# Altium schematic sheet SIM900A&W5500.SchDoc
size A2
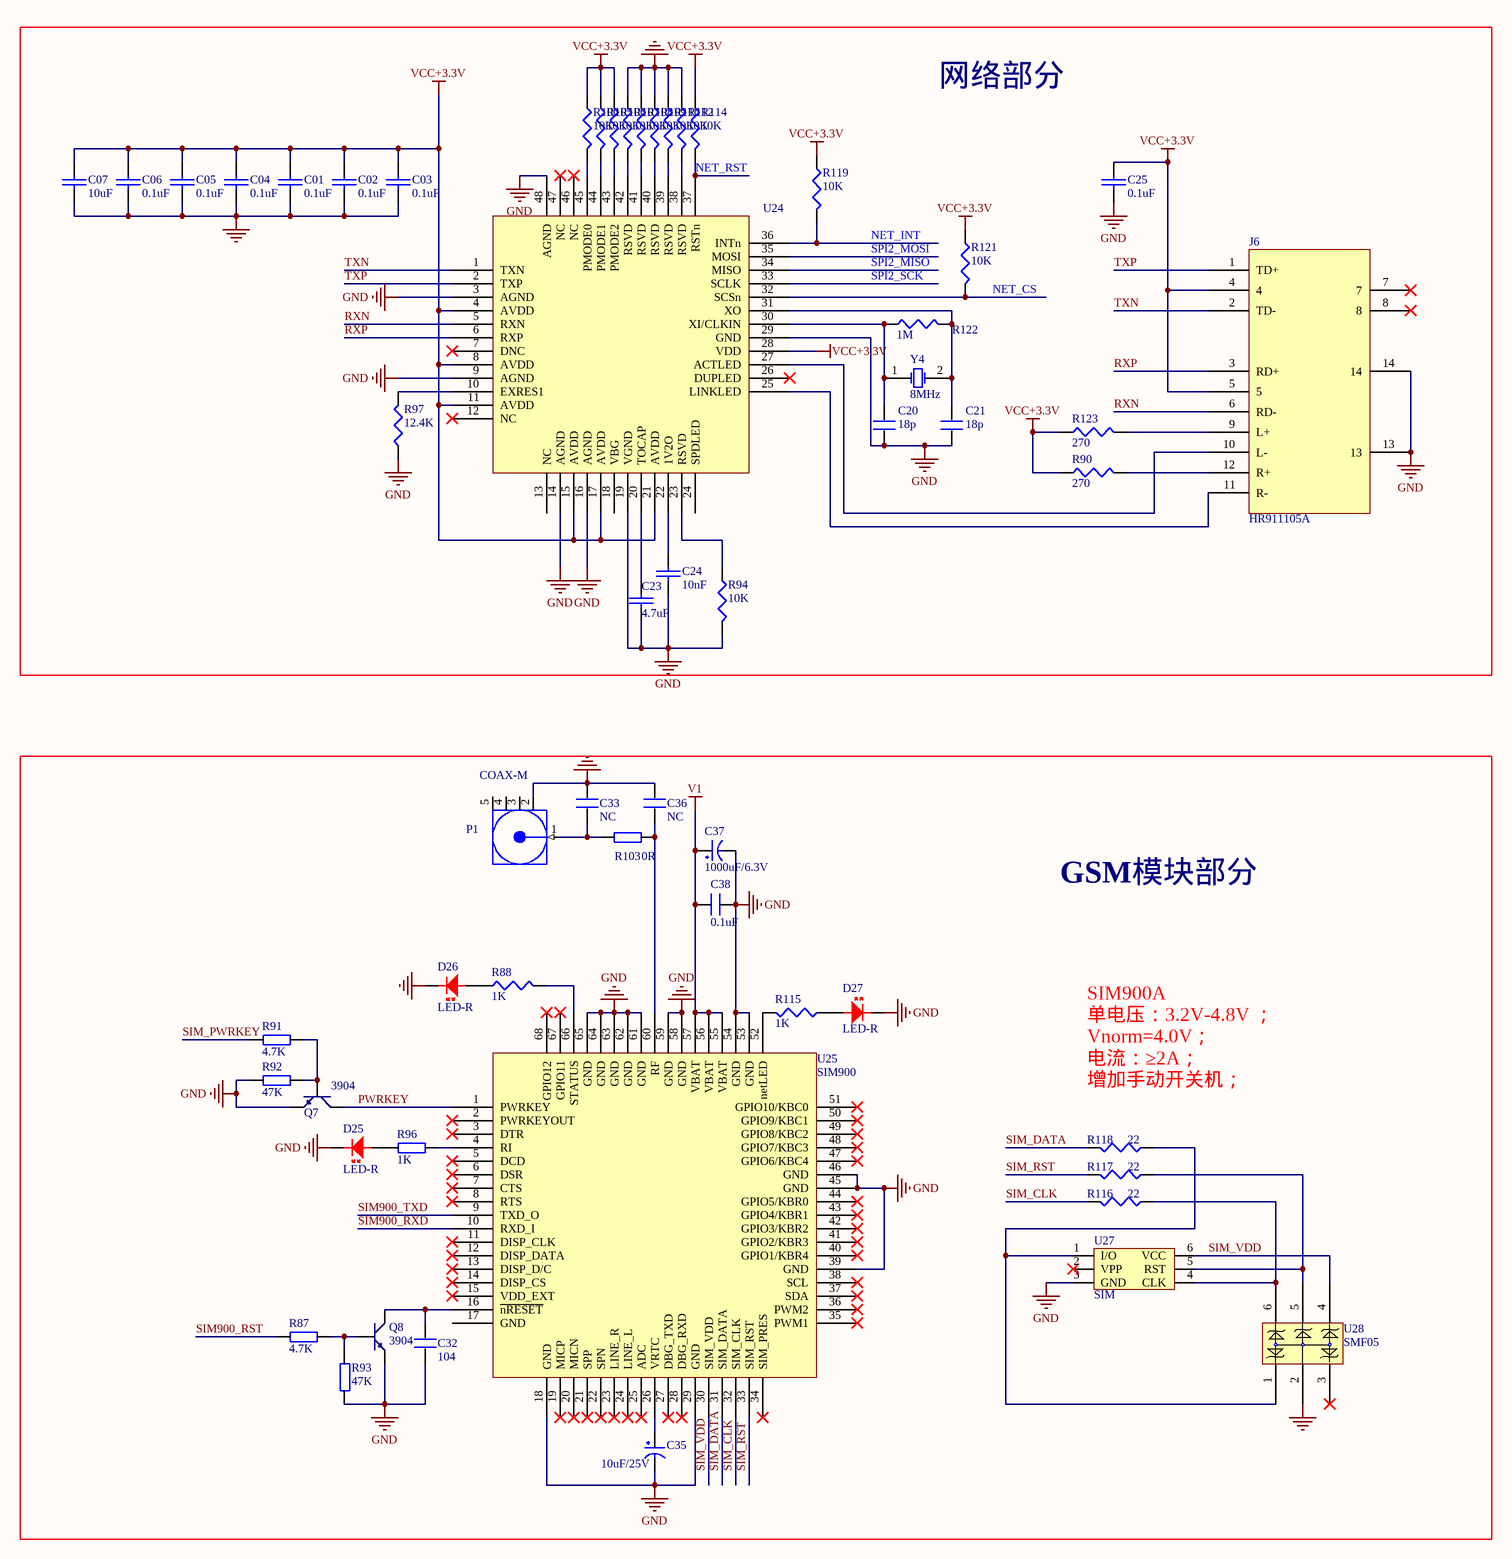
[diagram p0: SIM900A&W5500.SchDoc]

## Parts
C01  0.1uF  [0603]
C02  0.1uF  [0603]
C03  0.1uF  [0603]
C04  0.1uF  [0603]
C05  0.1uF  [0603]
C06  0.1uF  [0603]
C07  10uF  [0805]
C20  18p  [0603]
C21  18p  [0603]
C23  4.7uF  [0603]
C24  10nF  [0603]
C25  0.1uF  [0603]
C32  104  [0805]
C33  NC  [0805]
C35  10uF/25V  [1206]
C36  NC  [0805]
C37  1000uF/6.3V  [7343]
C38  0.1uF  [0805]
D25  LED-R  [LED-DIP]
D26  LED-R  [LED-DIP]
D27  LED-R  [LED-DIP]
J6  HR911105A  [HR911105A]
P1  COAX-M  [ST-TH1]
Q7  3904  [SOT-23R]
Q8  3904  [SOT-23R]
R87  4.7K  [0805]
R88  1K  [0805]
R90  270  [0603]
R91  4.7K  [0805]
R92  47K  [0805]
R93  47K  [0805]
R94  10K  [0603]
R96  1K  [0805]
R97  12.4K  [0603]
R100  10K  [0603]
R103  0R  [0603]
R105  10K  [0603]
R106  10K  [0603]
R107  10K  [0603]
R108  10K  [0603]
R109  10K  [0603]
R110  10K  [0603]
R112  10K  [0603]
R114  10K  [0603]
R115  1K  [0805]
R116  22  [0805]
R117  22  [0805]
R118  22  [0805]
R119  10K  [0603]
R121  10K  [0603]
R122  1M  [0603]
R123  270  [0603]
U24  W5500  [LQFP48_N]  (value not drawn)
U25  SIM900  [SIM-900]
U27  SIM  [sim-6p]
U28  SMF05  [SC70-6L]
Y4  8MHz  [XTAL_US]

## Blocks framed on the sheet
网络部分: C01 C02 C03 C04 C05 C06 C07 C20 C21 C23-C25 J6 R90 R94 R97 R100 R105-R110 R112 R114 R119 R121-R123 U24 Y4
GSM模块部分: C32 C33 C35-C38 D25-D27 P1 Q7 Q8 R87 R88 R91-R93 R96 R103 R115-R118 U25 U27 U28

## Nets
GND: C01.2 C02.2 C03.2 C04.2 C05.2 C06.2 C07.1 C20.1 C21.1 C23.1 C24.2 C25.2 C32.1 C33.2 C35.2(GND) C36.2 C37.2(GND) C38.2 D25.2 D26.2 D27.2 J6.13 J6.14 P1.2(GND) Q7.1(E) Q8.1(E) R92.1 R93.1 R94.2 R97.1 R107.1 R108.1 R109.1 R110.1 R112.1 U24.3(AGND) U24.9(AGND) U24.14(AGND) U24.16(AGND) U24.19(VGND) U24.29(GND) U24.48(AGND) U25.18(GND) U25.29(GND) U25.39(GND) U25.45(GND) U25.46(GND) U25.53(GND) U25.54(GND) U25.58(GND) U25.59(GND) U25.61(GND) U25.62(GND) U25.63(GND) U25.64(GND) U25.65(GND) U27.3(GND) U28.2
V1: C37.1(VCC) C38.1 U25.55(VBAT) U25.56(VBAT) U25.57(VBAT)
VCC+3.3V: C01.1 C02.1 C03.1 C04.1 C05.1 C06.1 C07.2 C25.1 J6.4 J6.5 R90.1 R100.1 R105.1 R106.1 R114.1 R119.1 R121.1 R123.1 U24.4(AVDD) U24.8(AVDD) U24.11(AVDD) U24.15(AVDD) U24.17(AVDD) U24.21(AVDD) U24.28(VDD)
NET_CS: R121.2 U24.32(SCSn)
NET_INT: R119.2 U24.36(INTn)
NET_RST: R114.2 U24.37(RSTn)
PWRKEY: Q7.3(C) U25.1(PWRKEY)
RXN: J6.6(RD-) U24.5(RXN)
RXP: J6.3(RD+) U24.6(RXP)
SIM900_RST: R87.1
SIM900_RXD: U25.10(RXD_I)
SIM900_TXD: U25.9(TXD_O)
SIM_CLK: R116.2 U25.32(SIM_CLK)
SIM_DATA: R118.2 U25.31(SIM_DATA)
SIM_PWRKEY: R91.1
SIM_RST: R117.2 U25.33(SIM_RST)
SIM_VDD: U25.30(SIM_VDD) U27.6(VCC) U28.4
SPI2_MISO: U24.34(MISO)
SPI2_MOSI: U24.35(MOSI)
SPI2_SCK: U24.33(SCLK)
TXN: J6.2(TD-) U24.1(TXN)
TXP: J6.1(TD+) U24.2(TXP)
NetC20_2: C20.2 R122.1 U24.30(XI/CLKIN) Y4.1(OSC1)
NetC21_2: C21.2 R122.2 U24.31(XO) Y4.2(OSC2)
NetC23_2: C23.2 U24.20(TOCAP)
NetC24_1: C24.1 U24.22(1V2O)
NetC32_2: C32.2 Q8.3(C) U25.16(~{nRESET})
NetC33_1: C33.1 P1.1(Signal) R103.1
NetC35_1: C35.1(VCC) U25.26(VRTC)
NetC36_1: C36.1 R103.2 U25.60(RF)
NetD25_1: D25.1 R96.1
NetD26_1: D26.1 R88.1
NetD27_1: D27.1 R115.1
NetJ6_9: J6.9(L+) R123.2
NetJ6_10: J6.10(L-) U24.27(ACTLED)
NetJ6_11: J6.11(R-) U24.25(LINKLED)
NetJ6_12: J6.12(R+) R90.2
NetQ7_2: Q7.2(B) R91.2 R92.2
NetQ8_2: Q8.2(B) R87.2 R93.2
NetR88_2: R88.2 U25.66(STATUS)
NetR94_1: R94.1 U24.23(RSVD)
NetR96_2: R96.2 U25.4(RI)
NetR97_2: R97.2 U24.10(EXRES1)
NetR100_2: R100.2 U24.45(PMODE0)
NetR105_2: R105.2 U24.44(PMODE1)
NetR106_2: R106.2 U24.43(PMODE2)
NetR107_2: R107.2 U24.42(RSVD)
NetR108_2: R108.2 U24.41(RSVD)
NetR109_2: R109.2 U24.40(RSVD)
NetR110_2: R110.2 U24.39(RSVD)
NetR112_2: R112.2 U24.38(RSVD)
NetR115_2: R115.2 U25.52(netLED)
NetR116_1: R116.1 U27.4(CLK) U28.6
NetR117_1: R117.1 U27.5(RST) U28.5
NetR118_1: R118.1 U27.1(I/O) U28.1

Not connected (* = marked no-connect by the designer): J6 7* 8*; P1 3(GND) 4(GND) 5(GND); U24 7(DNC)* 12(NC)* 13(NC) 18(VBG) 24(SPDLED) 26(DUPLED)* 46(NC)* 47(NC)*; U25 2(PWRKEYOUT)* 3(DTR)* 5(DCD)* 6(DSR)* 7(CTS)* 8(RTS)* 11(DISP_CLK)* 12(DISP_DATA)* 13(DISP_D/C)* 14(DISP_CS)* 15(VDD_EXT)* 17(GND) 19(MICP)* 20(MICN)* 21(SPP)* 22(SPN)* 23(LINE_R)* 24(LINE_L)* 25(ADC)* 27(DBG_TXD)* 28(DBG_RXD)* 34(SIM_PRES)* 35(PWM1)* 36(PWM2)* 37(SDA)* 38(SCL)* 40(GPIO1/KBR4)* 41(GPIO2/KBR3)* 42(GPIO3/KBR2)* 43(GPIO4/KBR1)* 44(GPIO5/KBR0)* 47(GPIO6/KBC4)* 48(GPIO7/KBC3)* 49(GPIO8/KBC2)* 50(GPIO9/KBC1)* 51(GPIO10/KBC0)* 67(GPIO11)* 68(GPIO12)*; U27 2(VPP)*; U28 3*

## Notes on the sheet
- (near R118) SIM900A
  单电压：3.2V-4.8V ；
  Vnorm=4.0V；
  电流：≥2A；
  增加手动开关机；

## Library data of the parts
C01 C02 C03 C04 C05 C06 C24 C25 C35 C37 = CAP
C07 C23 = CAP: 0.1uF
C20 C21 C32 C33 C36 C38 = C
D25-D27 = LED-RED: 红色LED
P1 = COAX-M: SMA-J-P-H-ST-TH1; PackageDocument: Rev. A, 16-Jun-1997; PCB_Layout: Complies with manufacturer's recommendation.; DrillSize: Corresponds to nominal value.; Published: 15-Jul-2004; LatestRevisionDate: 15-Jul-2004; LatestRevisionNote: Component Replaced.; DatasheetDocument: 30-May-2003; PackageReference: 908-21103; Publisher: Altium Limited; ComponentLink1Description: Manufacturer Link; ComponentLink1URL: http://www.amphenolrf.com/
Q7 Q8 = NPN: 8050/BCW846/BCW847
R87 R91-R93 R96 R103 = Res
R88 R90 R94 R97 R100 R105-R110 R112 R114-R119 R121-R123 = RES1
U24 = W5500: 以太网
U27 = SIM: 手机SIM卡
Y4 = XTAL: Crystal Oscillator; Published: 8-Jun-2000; LatestRevisionDate: 17-Jul-2002; LatestRevisionNote: Re-released for DXP Platform.; Publisher: Altium Limited